# Altium schematic sheet RF_And_SD_Ticketing_Master.SchDoc
size A4; Organization: ETML-ES; Address1: Avenue Recordon 1; Address2: 1004 Lausanne; Address3: Switzerland
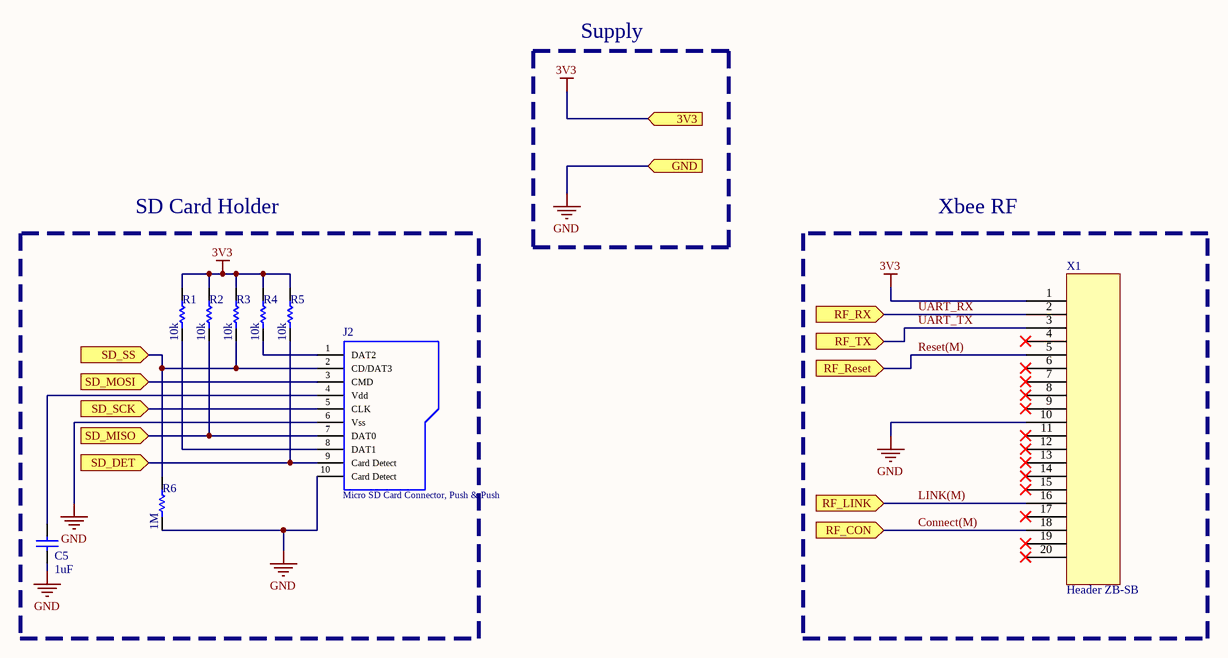
[diagram p0: RF_And_SD_Ticketing_Master.SchDoc]

## Parts
C5  1uF  [6-0805_N]
J2  Micro SD Card Connector, Push & Push  [693071010811]
R1  10k  [RESC0805(2012)_L]
R2  10k  [RESC0805(2012)_L]
R3  10k  [RESC0805(2012)_L]
R4  10k  [RESC0805(2012)_L]
R5  10k  [RESC0805(2012)_L]
R6  1M  [RESC0805(2012)_L]
X1  Header ZB-SB  [ZB-SB]

## Blocks framed on the sheet
Xbee RF: X1

## Ports
3V3, GND, RF_CON, RF_LINK, RF_Reset, RF_RX, RF_TX, SD_DET, SD_MISO, SD_MOSI, SD_SCK, SD_SS

## Nets
3V3: R1.2 R2.2 R3.2 R4.2 R5.2 X1.1 ; port 3V3
GND: C5.1 J2.6(Vss) J2.10(Card_Detect) R6.1 X1.10 ; port GND
Connect(M): X1.18 ; port RF_CON
LINK(M): X1.16 ; port RF_LINK
Reset(M): X1.5 ; port RF_Reset
SD_DET: J2.9(Card_Detect) R5.1 ; port SD_DET
SD_MISO: J2.7(DAT0) R2.1 ; port SD_MISO
SD_MOSI: J2.3(CMD) ; port SD_MOSI
SD_SCK: J2.5(CLK) ; port SD_SCK
SD_SS: J2.2(CD/DAT3) R3.1 R6.2 ; port SD_SS
UART_RX: X1.2 ; port RF_RX
UART_TX: X1.3 ; port RF_TX
NetC5_2: C5.2 J2.4(Vdd)
NetJ2_1: J2.1(DAT2) R4.1
NetJ2_8: J2.8(DAT1) R1.1

Not connected (* = marked no-connect by the designer): X1 4* 6* 7* 8* 9* 11* 12* 13* 14* 15* 17* 19* 20*

## Notes on the sheet
- Supply
- SD Card Holder
- Fichier :
- Date :
- Heure :
- Projet :
- Auteur :
- Version :
- Chemin :

## Library data of the parts
C5 = CMP-1036-04930-1: CAP 10uF 16V ±20% 0805 (2012 Metric) Thickness 1mm SMD; Case-Metric: 2012; Case-EIA: 0805; Tolerance: Â±20%; Value: 10uF; Rated Voltage: 16 V; Technology: SMT; Max Thickness: 1 mm
J2 = 693071010811: WR-CRD Micro SD Card Connector, Push & Push, with card detection; Rated Current: 0.5A; Working Voltage: 500V AC; ComponentLink1Description: Manufacturer; ComponentLink1URL: http://www.we-online.de; ComponentLink2Description: Datasheet; ComponentLink2URL: http://katalog.we-online.de/em/datasheet/693071010811.pdf; Part Number: 693071010811; Published Date: Feb. 2018; Publisher: Wurth Elektronik; Operating Temperature: -25 to 85 degC; Mounting Technology: SMT
R1-R6 = CMP-1013-00122-1: 100K 0.125W 5% 0805 (2012 Metric)  SMD; Case-Metric: 2012; Case-EIA: 0805; Tolerance: 5 %; Technology: SMT; Power: 0.125 W
  R1-R5: Value: 10k
  R6: Value: 1M
X1 = HDR ZB-SB 2x10: Header 2x10; PackageCase: XBee; Value: 2x10